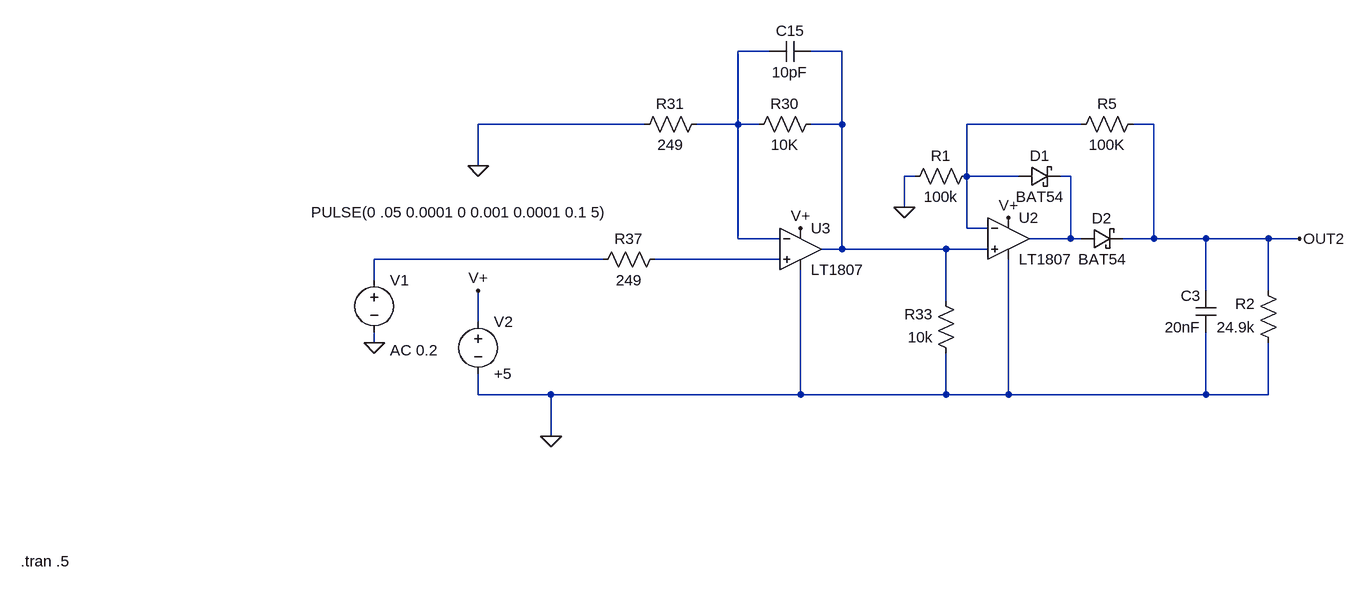
[diagram p0: schematic Muons01.asc]
Muons01.asc, the LTspice schematic file:
Version 4
SHEET 1 5945676 13421556
WIRE 624 -368 576 -368
WIRE 736 -368 688 -368
WIRE 432 -256 176 -256
WIRE 576 -256 576 -368
WIRE 576 -256 512 -256
WIRE 608 -256 576 -256
WIRE 736 -256 736 -368
WIRE 736 -256 688 -256
WIRE 1104 -256 928 -256
WIRE 1216 -256 1184 -256
WIRE 176 -192 176 -256
WIRE 848 -176 832 -176
WIRE 928 -176 928 -256
WIRE 1008 -176 928 -176
WIRE 1088 -176 1072 -176
WIRE 832 -128 832 -176
WIRE 928 -96 928 -176
WIRE 960 -96 928 -96
WIRE 576 -80 576 -256
WIRE 640 -80 576 -80
WIRE 1088 -80 1088 -176
WIRE 1088 -80 1024 -80
WIRE 1104 -80 1088 -80
WIRE 1216 -80 1216 -256
WIRE 1216 -80 1168 -80
WIRE 1296 -80 1216 -80
WIRE 1392 -80 1296 -80
WIRE 1440 -80 1392 -80
WIRE 736 -64 736 -256
WIRE 736 -64 704 -64
WIRE 896 -64 736 -64
WIRE 960 -64 896 -64
WIRE 368 -48 16 -48
WIRE 640 -48 448 -48
WIRE 16 -16 16 -48
WIRE 1296 0 1296 -80
WIRE 1392 0 1392 -80
WIRE 896 16 896 -64
WIRE 176 48 176 0
WIRE 16 80 16 64
WIRE 176 160 176 128
WIRE 288 160 176 160
WIRE 672 160 672 -32
WIRE 672 160 288 160
WIRE 896 160 896 96
WIRE 896 160 672 160
WIRE 992 160 992 -48
WIRE 992 160 896 160
WIRE 1296 160 1296 64
WIRE 1296 160 992 160
WIRE 1392 160 1392 80
WIRE 1392 160 1296 160
WIRE 288 224 288 160
FLAG 16 80 0
FLAG 288 224 0
FLAG 672 -96 V+
FLAG 176 0 V+
FLAG 176 -192 0
FLAG 1440 -80 OUT2
FLAG 992 -112 V+
FLAG 832 -128 0
SYMBOL voltage 16 -32 R0
WINDOW 123 24 124 Left 2
WINDOW 39 0 0 Left 0
WINDOW 3 -97 -89 Left 2
SYMATTR Value2 AC 0.2
SYMATTR Value PULSE(0 .05 0.0001 0 0.001 0.0001 0.1 5)
SYMATTR InstName V1
SYMBOL res 704 -272 R90
WINDOW 0 0 56 VBottom 2
WINDOW 3 32 56 VTop 2
SYMATTR InstName R30
SYMATTR Value 10K
SYMBOL res 464 -64 R90
WINDOW 0 0 56 VBottom 2
WINDOW 3 32 56 VTop 2
SYMATTR InstName R37
SYMATTR Value 249
SYMBOL res 528 -272 R90
WINDOW 0 0 56 VBottom 2
WINDOW 3 32 56 VTop 2
SYMATTR InstName R31
SYMATTR Value 249
SYMBOL cap 688 -384 R90
WINDOW 0 0 32 VBottom 2
WINDOW 3 32 32 VTop 2
SYMATTR InstName C15
SYMATTR Value 10pF
SYMBOL voltage 176 32 R0
WINDOW 123 0 0 Left 0
WINDOW 39 0 0 Left 0
SYMATTR InstName V2
SYMATTR Value +5
SYMBOL res 912 112 R180
WINDOW 0 36 76 Left 2
WINDOW 3 36 40 Left 2
SYMATTR InstName R33
SYMATTR Value 10k
SYMBOL res 1200 -272 R90
WINDOW 0 0 56 VBottom 2
WINDOW 3 32 56 VTop 2
SYMATTR InstName R5
SYMATTR Value 100K
SYMBOL cap 1312 64 R180
WINDOW 0 24 56 Left 2
WINDOW 3 24 8 Left 2
SYMATTR InstName C3
SYMATTR Value 20nF
SYMBOL OpAmps\\LT1807 992 -144 R0
SYMATTR InstName U2
SYMBOL OpAmps\\LT1807 672 -128 R0
SYMATTR InstName U3
SYMBOL res 944 -192 R90
WINDOW 0 0 56 VBottom 2
WINDOW 3 32 56 VTop 2
SYMATTR InstName R1
SYMATTR Value 100k
SYMBOL schottky 1008 -160 R270
WINDOW 0 32 32 VTop 2
WINDOW 3 0 32 VBottom 2
SYMATTR InstName D1
SYMATTR Value BAT54
SYMATTR Description Diode
SYMATTR Type diode
SYMBOL schottky 1104 -64 R270
WINDOW 0 32 32 VTop 2
WINDOW 3 0 32 VBottom 2
SYMATTR InstName D2
SYMATTR Value BAT54
SYMATTR Description Diode
SYMATTR Type diode
SYMBOL res 1408 96 R180
WINDOW 0 36 76 Left 2
WINDOW 3 36 40 Left 2
SYMATTR InstName R2
SYMATTR Value 24.9k
TEXT -528 416 Left 2 !.tran .5

The netlist it stands for:
* Muons01.asc
V1 N005 0 PULSE(0 .05 0.0001 0 0.001 0.0001 0.1 5) AC 0.2
R30 N002 N001 10K
R37 N006 N005 249
R31 N001 0 249
C15 N002 N001 10pF
V2 V+ 0 +5
R33 0 N002 10k
R5 OUT2 N003 100K
C3 0 OUT2 20nF
XU2 N002 N003 V+ 0 N004 LT1807  ; pins In+ In- V+ V- OUT
XU3 N006 N001 V+ 0 N002 LT1807  ; pins In+ In- V+ V- OUT
R1 N003 0 100k
D1 N003 N004 BAT54
D2 N004 OUT2 BAT54
R2 0 OUT2 24.9k
.model D D
.lib standard.dio
.tran .5
.backanno
.end